# EasyEDA schematic SCH_Christmas-Tree-1_2024-12-28.json
TITLE: Sheet_1; REV: 1.0; Date: 2024-02-19; Sheet: 1/1; Drawn By: errolrodrigue19; Company: Your Company
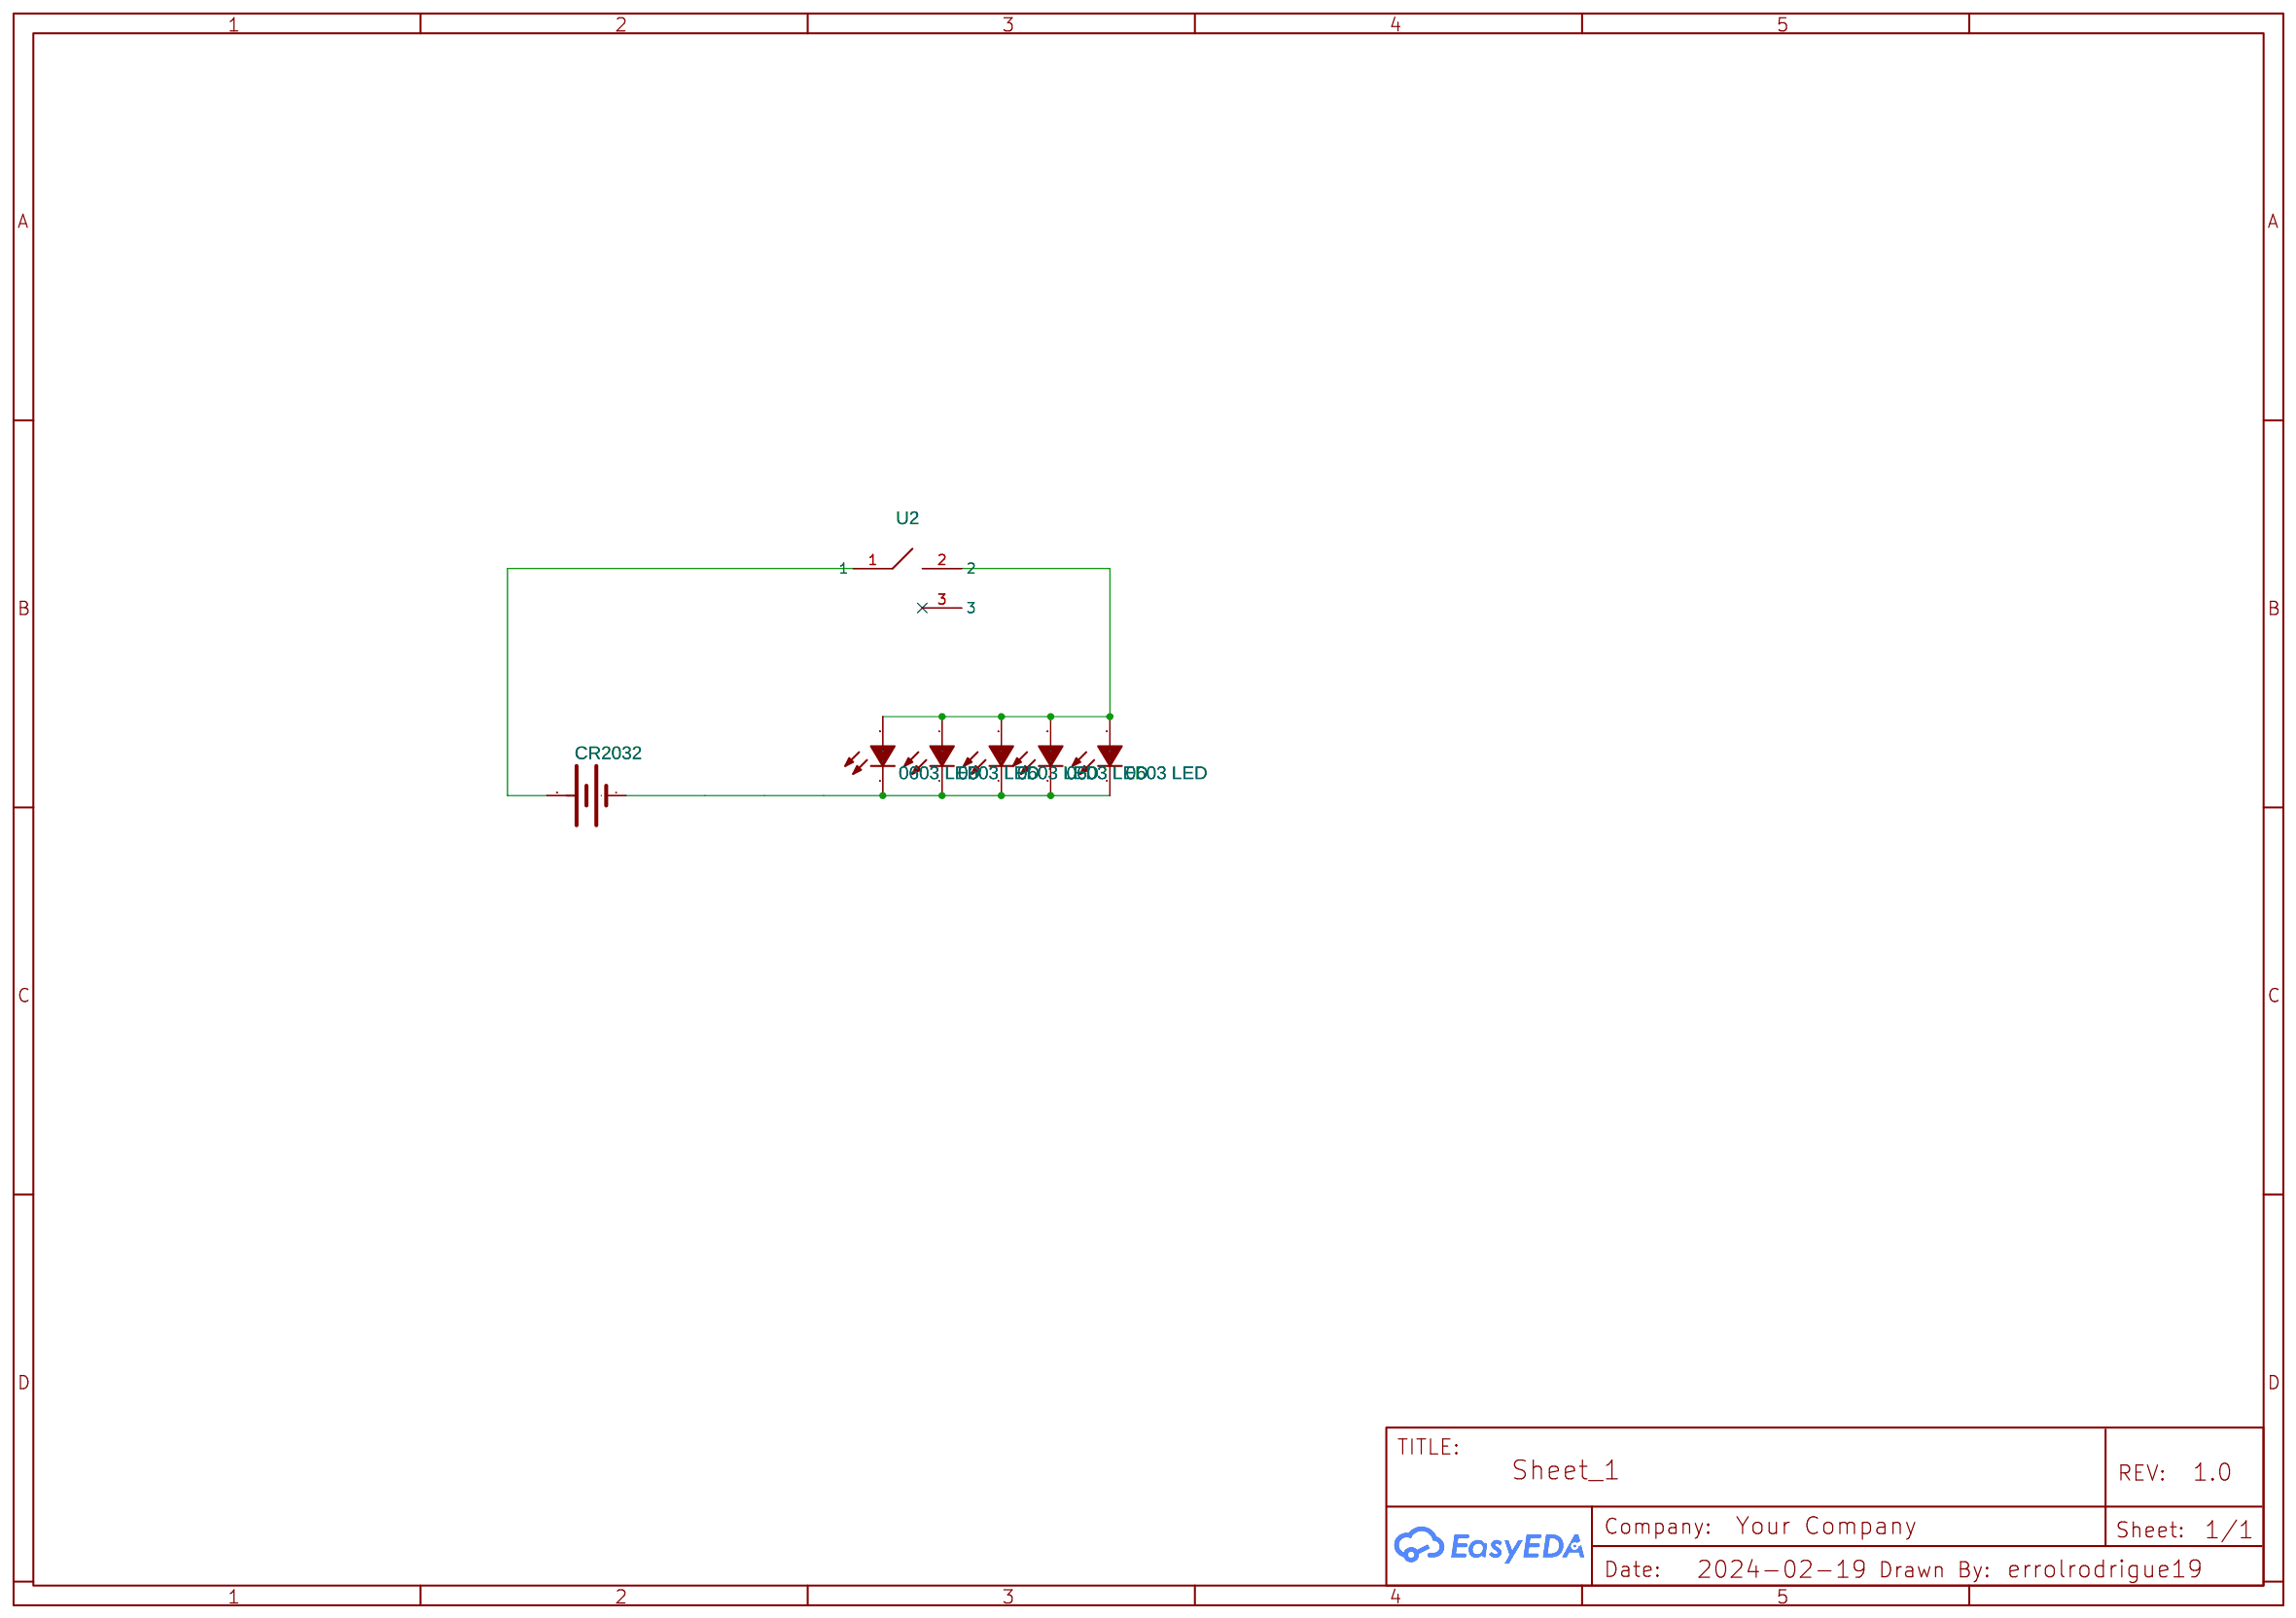
[diagram p0: schematic sheet]

## Parts
LED2  0603 LED  [LED0603-RD]
LED3  0603 LED  [LED0603-RD]
LED4  0603 LED  [LED0603-RD]
LED7  0603 LED  [LED0603-RD]
LED8  0603 LED  [LED0603-RD]
U1  CR2032  [BAT-SMD_CR2032-C9900005595]
U2  拨键开关MSK-12C02  [SW-SMD_3P-MSK12C02]

## Library data of the parts
LED2-LED4 LED7 LED8 = LED-0603: Contributor: lcsc; Supplier: LCSC; Supplier Part: C9900020572; Manufacturer: null; JLCPCB Part Class: Extended Part
U1 = CR2032-卧式贴片: Contributor: LCSC; Supplier: LCSC; Supplier Part: C9900005595; Manufacturer: null; JLCPCB Part Class: Extended Part
U2 = 拨键开关MSK-12C02: Contributor: lcsc; Supplier: LCSC; Supplier Part: C9900021285; Manufacturer: null; JLCPCB Part Class: Extended Part

## Nets
Net-(LED2-1): LED2.1(-) LED3.1(-) LED4.1(-) LED7.1(-) LED8.1(-) U1.1(-)
Net-(LED2-2): LED2.2(+) LED3.2(+) LED4.2(+) LED7.2(+) LED8.2(+) U2.2
Net-(U1-2): U1.2(+) U2.1

Not connected (* = marked no-connect by the designer): U2 3*
